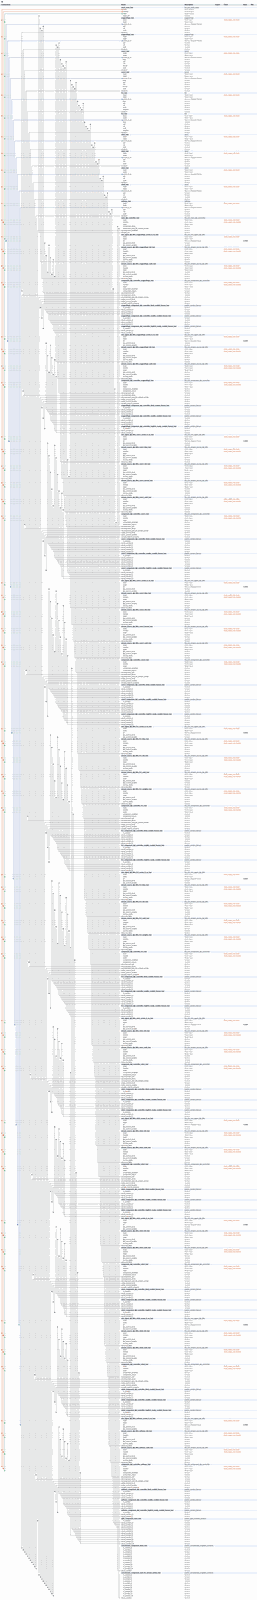
[diagram p0: system contents, whole]
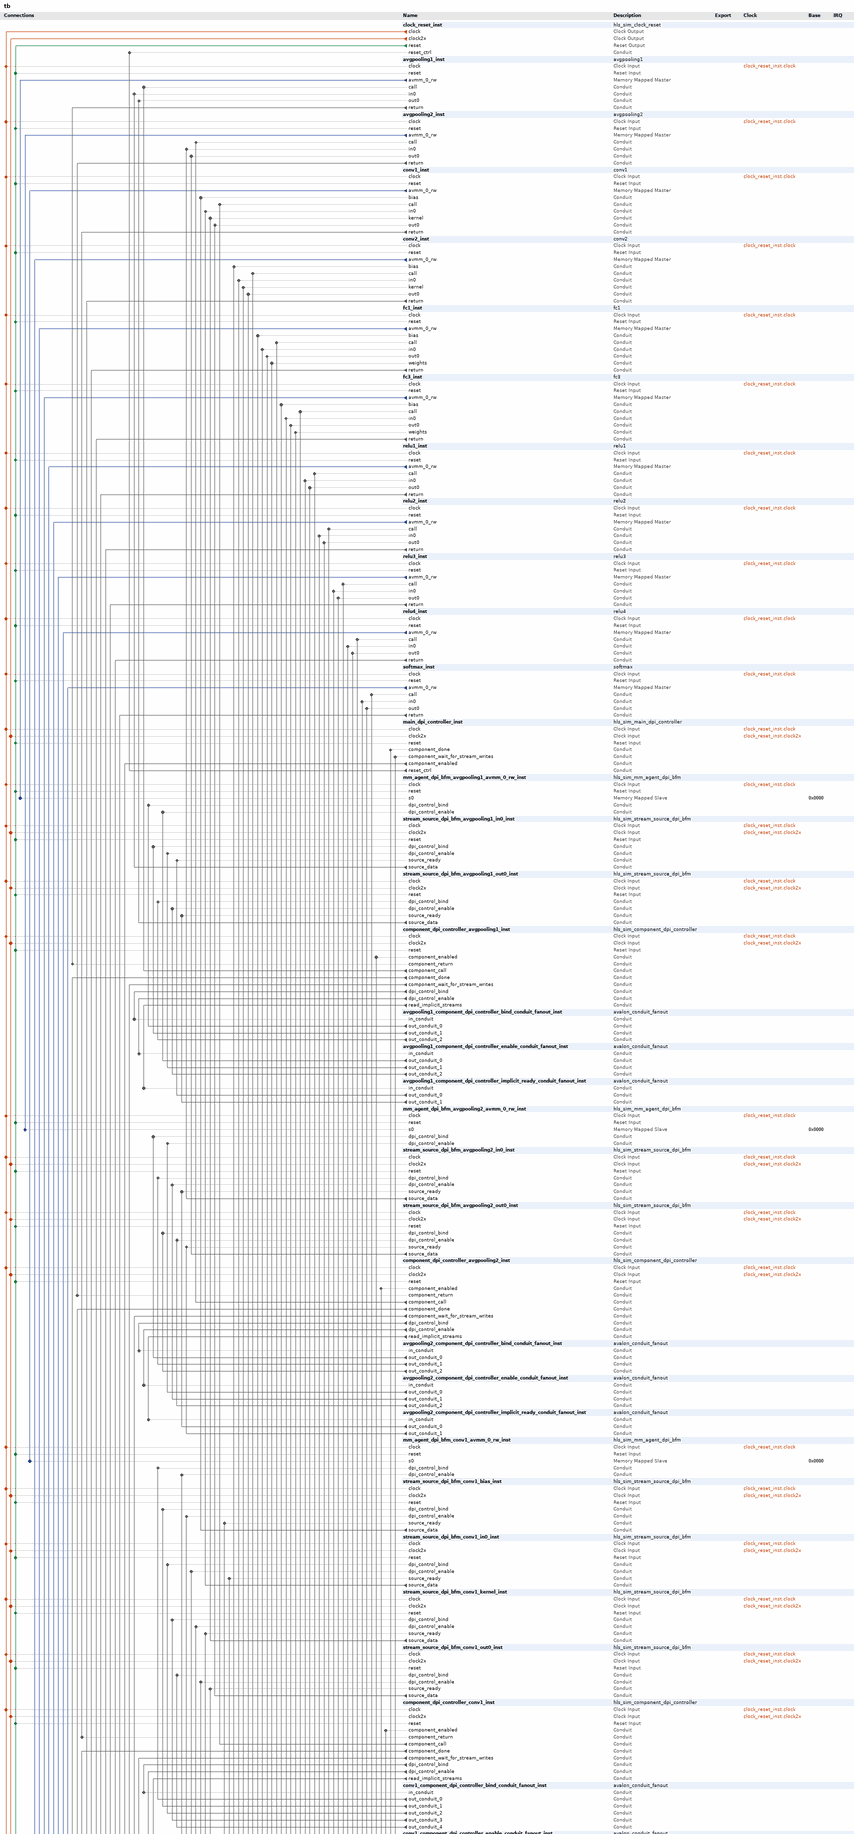
[diagram p1: system contents, upper part]
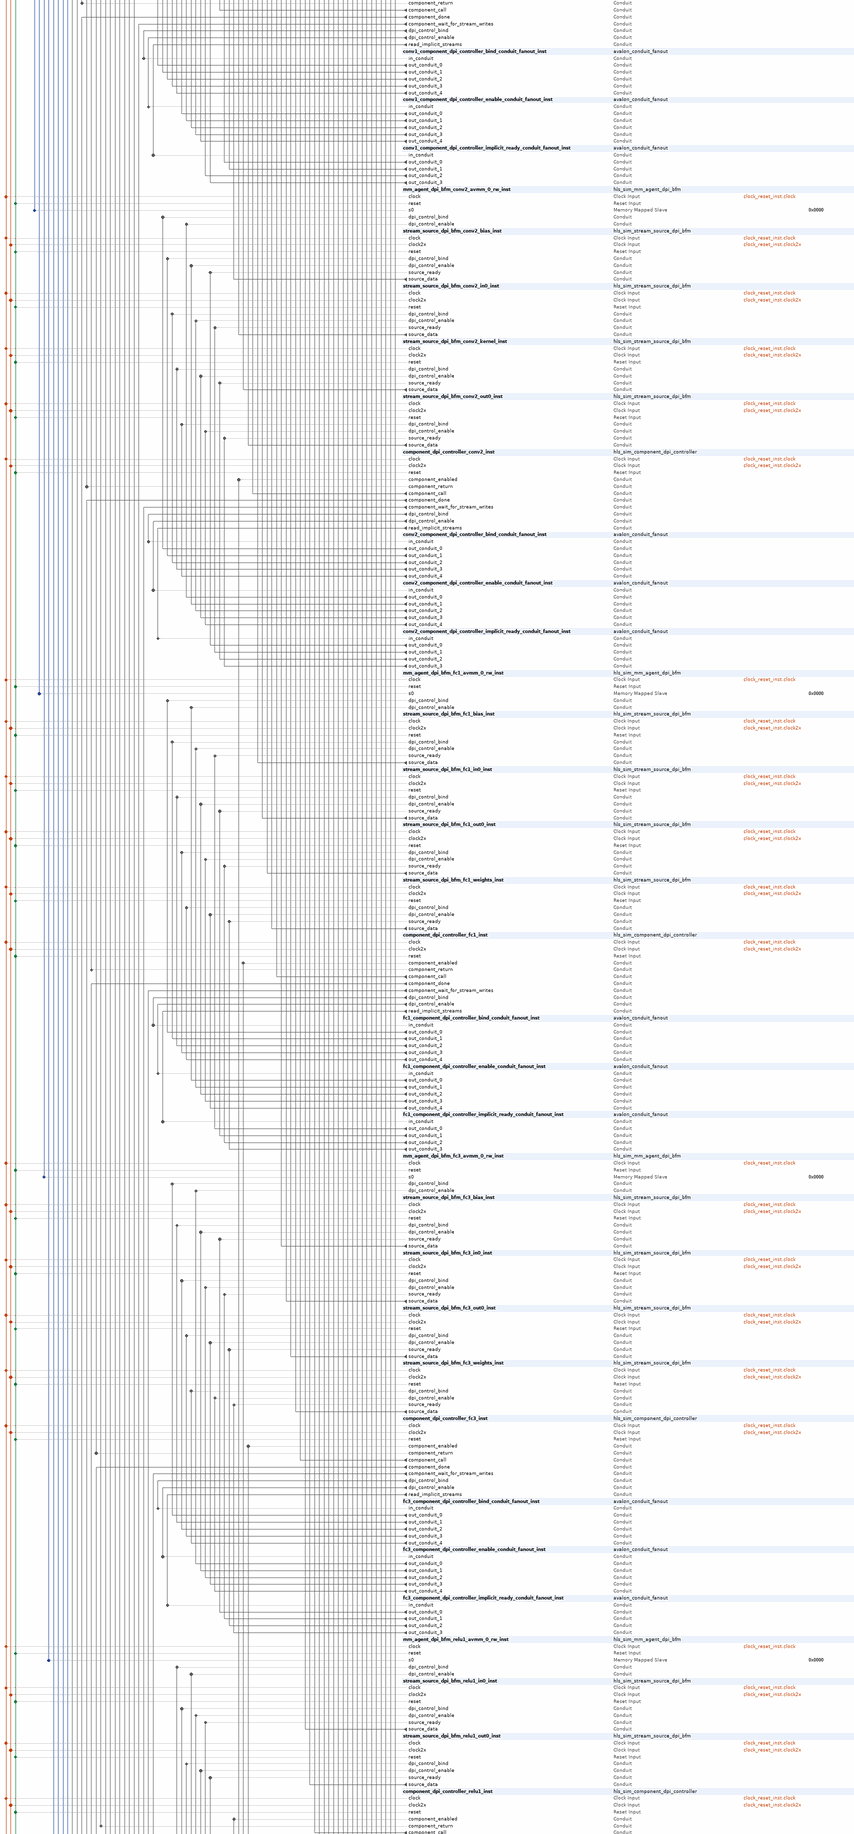
[diagram p2: system contents, middle part]
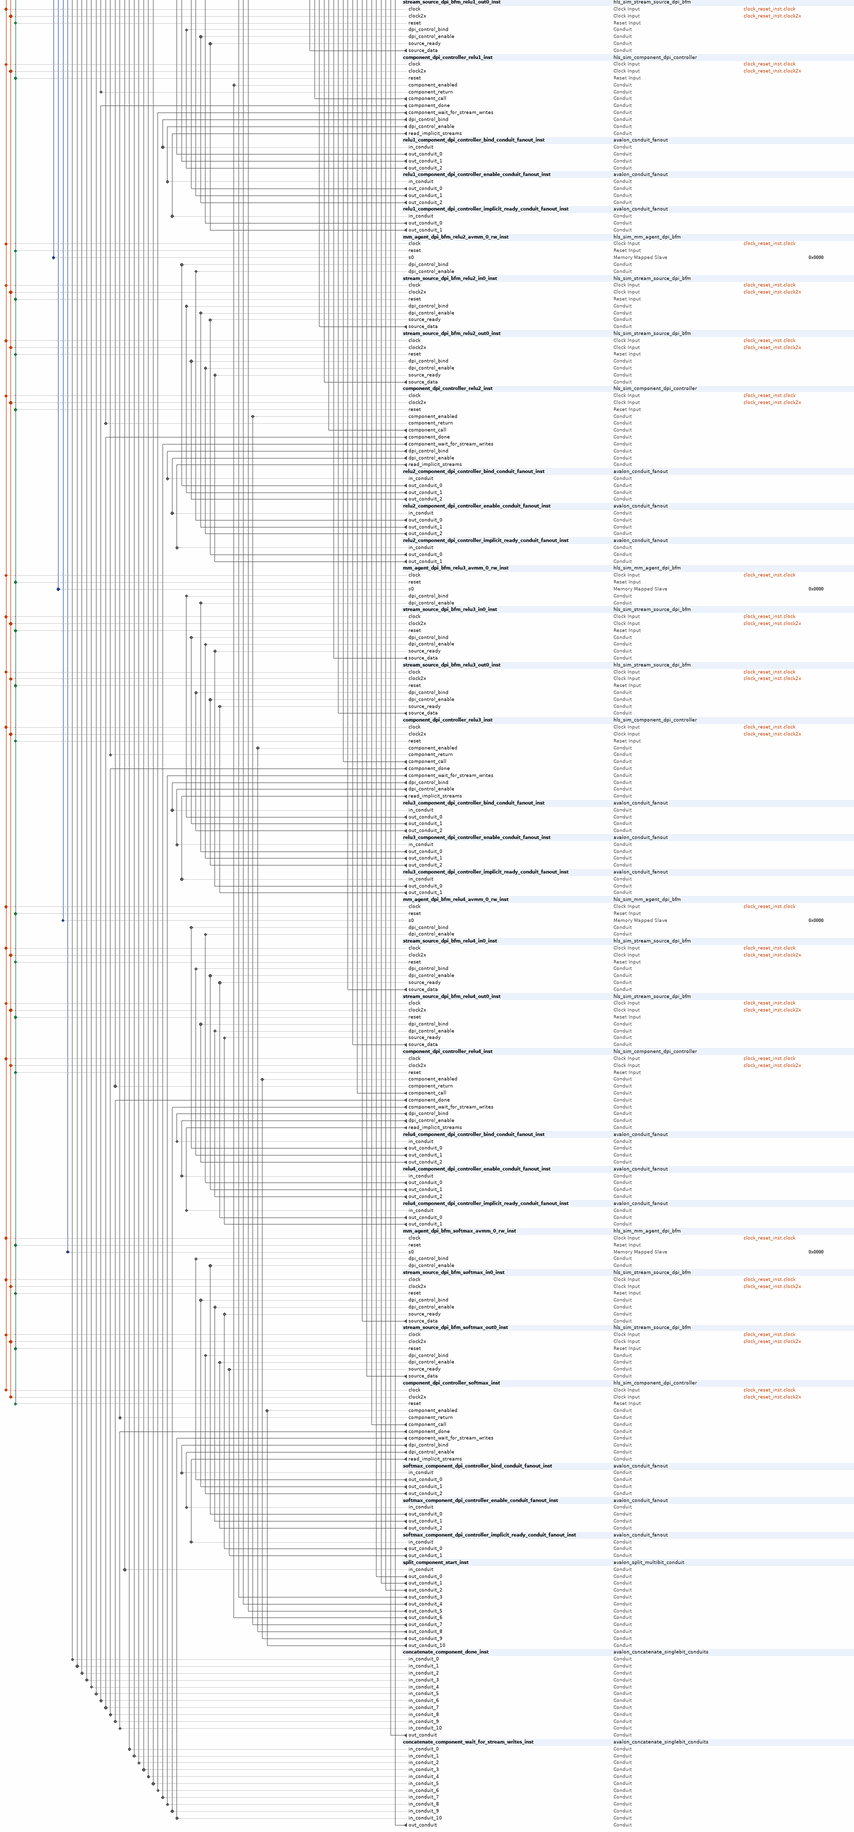
[diagram p3: system contents, lower part]
# Platform Designer (Qsys) system tb, Cyclone V 5CGXFC3B6F23C6
# Parameters at their usual value, and those the tool derives, are not listed.
package require qsys
create_system tb
set_project_property DEVICE_FAMILY {Cyclone V}
set_project_property DEVICE 5CGXFC3B6F23C6

add_instance clock_reset_inst hls_sim_clock_reset 1.0
set_instance_parameter_value clock_reset_inst RESET_CYCLE_HOLD 4

add_instance avgpooling1_inst avgpooling1 1.0

add_instance avgpooling2_inst avgpooling2 1.0

add_instance conv1_inst conv1 1.0

add_instance conv2_inst conv2 1.0

add_instance fc1_inst fc1 1.0

add_instance fc3_inst fc3 1.0

add_instance relu1_inst relu1 1.0

add_instance relu2_inst relu2 1.0

add_instance relu3_inst relu3 1.0

add_instance relu4_inst relu4 1.0

add_instance softmax_inst softmax 1.0

add_instance main_dpi_controller_inst hls_sim_main_dpi_controller 1.0
set_instance_parameter_value main_dpi_controller_inst COMPONENT_NAMES_STR avgpooling1,avgpooling2,conv1,conv2,fc1,fc3,relu1,relu2,relu3,relu4,softmax
set_instance_parameter_value main_dpi_controller_inst NUM_COMPONENTS 11

add_instance mm_agent_dpi_bfm_avgpooling1_avmm_0_rw_inst hls_sim_mm_agent_dpi_bfm 1.0
set_instance_parameter_value mm_agent_dpi_bfm_avgpooling1_avmm_0_rw_inst ADDRESS_UNITS SYMBOLS
set_instance_parameter_value mm_agent_dpi_bfm_avgpooling1_avmm_0_rw_inst ASSERT_HIGH_ARBITERLOCK 1
set_instance_parameter_value mm_agent_dpi_bfm_avgpooling1_avmm_0_rw_inst ASSERT_HIGH_BYTEENABLE 1
set_instance_parameter_value mm_agent_dpi_bfm_avgpooling1_avmm_0_rw_inst ASSERT_HIGH_LOCK 1
set_instance_parameter_value mm_agent_dpi_bfm_avgpooling1_avmm_0_rw_inst ASSERT_HIGH_READ 1
set_instance_parameter_value mm_agent_dpi_bfm_avgpooling1_avmm_0_rw_inst ASSERT_HIGH_READDATAVALID 1
set_instance_parameter_value mm_agent_dpi_bfm_avgpooling1_avmm_0_rw_inst ASSERT_HIGH_WAITREQUEST 1
set_instance_parameter_value mm_agent_dpi_bfm_avgpooling1_avmm_0_rw_inst ASSERT_HIGH_WRITE 1
set_instance_parameter_value mm_agent_dpi_bfm_avgpooling1_avmm_0_rw_inst AV_ADDRESS_W 64
set_instance_parameter_value mm_agent_dpi_bfm_avgpooling1_avmm_0_rw_inst AV_BURSTCOUNT_W 3
set_instance_parameter_value mm_agent_dpi_bfm_avgpooling1_avmm_0_rw_inst AV_BURST_BNDR_ONLY 1
set_instance_parameter_value mm_agent_dpi_bfm_avgpooling1_avmm_0_rw_inst AV_BURST_LINEWRAP 1
set_instance_parameter_value mm_agent_dpi_bfm_avgpooling1_avmm_0_rw_inst AV_FIX_READ_LATENCY 1
set_instance_parameter_value mm_agent_dpi_bfm_avgpooling1_avmm_0_rw_inst AV_MAX_PENDING_READS 0
set_instance_parameter_value mm_agent_dpi_bfm_avgpooling1_avmm_0_rw_inst AV_MAX_PENDING_WRITES 0
set_instance_parameter_value mm_agent_dpi_bfm_avgpooling1_avmm_0_rw_inst AV_NUMSYMBOLS 8
set_instance_parameter_value mm_agent_dpi_bfm_avgpooling1_avmm_0_rw_inst AV_READRESPONSE_W 8
set_instance_parameter_value mm_agent_dpi_bfm_avgpooling1_avmm_0_rw_inst AV_READ_WAIT_TIME 0
set_instance_parameter_value mm_agent_dpi_bfm_avgpooling1_avmm_0_rw_inst AV_REGISTERINCOMINGSIGNALS 0
set_instance_parameter_value mm_agent_dpi_bfm_avgpooling1_avmm_0_rw_inst AV_SYMBOL_W 8
set_instance_parameter_value mm_agent_dpi_bfm_avgpooling1_avmm_0_rw_inst AV_WRITERESPONSE_W 8
set_instance_parameter_value mm_agent_dpi_bfm_avgpooling1_avmm_0_rw_inst AV_WRITE_WAIT_TIME 0
set_instance_parameter_value mm_agent_dpi_bfm_avgpooling1_avmm_0_rw_inst COMPONENT_NAME avgpooling1
set_instance_parameter_value mm_agent_dpi_bfm_avgpooling1_avmm_0_rw_inst INTERFACE_ID 0
set_instance_parameter_value mm_agent_dpi_bfm_avgpooling1_avmm_0_rw_inst REGISTER_WAITREQUEST 0
set_instance_parameter_value mm_agent_dpi_bfm_avgpooling1_avmm_0_rw_inst USE_ADDRESS 1
set_instance_parameter_value mm_agent_dpi_bfm_avgpooling1_avmm_0_rw_inst USE_ARBITERLOCK 0
set_instance_parameter_value mm_agent_dpi_bfm_avgpooling1_avmm_0_rw_inst USE_BEGIN_BURST_TRANSFER 0
set_instance_parameter_value mm_agent_dpi_bfm_avgpooling1_avmm_0_rw_inst USE_BEGIN_TRANSFER 0
set_instance_parameter_value mm_agent_dpi_bfm_avgpooling1_avmm_0_rw_inst USE_BURSTCOUNT 0
set_instance_parameter_value mm_agent_dpi_bfm_avgpooling1_avmm_0_rw_inst USE_BYTE_ENABLE 1
set_instance_parameter_value mm_agent_dpi_bfm_avgpooling1_avmm_0_rw_inst USE_CLKEN 0
set_instance_parameter_value mm_agent_dpi_bfm_avgpooling1_avmm_0_rw_inst USE_DEBUGACCESS 0
set_instance_parameter_value mm_agent_dpi_bfm_avgpooling1_avmm_0_rw_inst USE_LOCK 0
set_instance_parameter_value mm_agent_dpi_bfm_avgpooling1_avmm_0_rw_inst USE_READ 1
set_instance_parameter_value mm_agent_dpi_bfm_avgpooling1_avmm_0_rw_inst USE_READ_DATA 1
set_instance_parameter_value mm_agent_dpi_bfm_avgpooling1_avmm_0_rw_inst USE_READ_DATA_VALID 0
set_instance_parameter_value mm_agent_dpi_bfm_avgpooling1_avmm_0_rw_inst USE_WAIT_REQUEST 0
set_instance_parameter_value mm_agent_dpi_bfm_avgpooling1_avmm_0_rw_inst USE_WRITE 1
set_instance_parameter_value mm_agent_dpi_bfm_avgpooling1_avmm_0_rw_inst USE_WRITE_DATA 1

add_instance stream_source_dpi_bfm_avgpooling1_in0_inst hls_sim_stream_source_dpi_bfm 1.0
set_instance_parameter_value stream_source_dpi_bfm_avgpooling1_in0_inst COMPONENT_NAME avgpooling1
set_instance_parameter_value stream_source_dpi_bfm_avgpooling1_in0_inst EMPTY_WIDTH 0
set_instance_parameter_value stream_source_dpi_bfm_avgpooling1_in0_inst FIRST_SYMBOL_IN_HIGH_ORDER_BITS 0
set_instance_parameter_value stream_source_dpi_bfm_avgpooling1_in0_inst FORCE_STREAM_CONDUIT 1
set_instance_parameter_value stream_source_dpi_bfm_avgpooling1_in0_inst INTERFACE_NAME in
set_instance_parameter_value stream_source_dpi_bfm_avgpooling1_in0_inst STREAM_BITSPERSYMBOL 1
set_instance_parameter_value stream_source_dpi_bfm_avgpooling1_in0_inst STREAM_DATAWIDTH 64
set_instance_parameter_value stream_source_dpi_bfm_avgpooling1_in0_inst USES_PACKETS 0

add_instance stream_source_dpi_bfm_avgpooling1_out0_inst hls_sim_stream_source_dpi_bfm 1.0
set_instance_parameter_value stream_source_dpi_bfm_avgpooling1_out0_inst COMPONENT_NAME avgpooling1
set_instance_parameter_value stream_source_dpi_bfm_avgpooling1_out0_inst EMPTY_WIDTH 0
set_instance_parameter_value stream_source_dpi_bfm_avgpooling1_out0_inst FIRST_SYMBOL_IN_HIGH_ORDER_BITS 0
set_instance_parameter_value stream_source_dpi_bfm_avgpooling1_out0_inst FORCE_STREAM_CONDUIT 1
set_instance_parameter_value stream_source_dpi_bfm_avgpooling1_out0_inst INTERFACE_NAME out
set_instance_parameter_value stream_source_dpi_bfm_avgpooling1_out0_inst STREAM_BITSPERSYMBOL 1
set_instance_parameter_value stream_source_dpi_bfm_avgpooling1_out0_inst STREAM_DATAWIDTH 64
set_instance_parameter_value stream_source_dpi_bfm_avgpooling1_out0_inst USES_PACKETS 0

add_instance component_dpi_controller_avgpooling1_inst hls_sim_component_dpi_controller 1.0
set_instance_parameter_value component_dpi_controller_avgpooling1_inst COMPONENT_HAS_AGENT_RETURN 0
set_instance_parameter_value component_dpi_controller_avgpooling1_inst COMPONENT_MANGLED_NAME "\\3favgpooling1@@YAXQEAY1BM@BM@MQEAY1O@O@M@Z"
set_instance_parameter_value component_dpi_controller_avgpooling1_inst COMPONENT_NAME avgpooling1
set_instance_parameter_value component_dpi_controller_avgpooling1_inst COMPONENT_NUM_AGENTS 0
set_instance_parameter_value component_dpi_controller_avgpooling1_inst COMPONENT_NUM_OUTPUT_STREAMS 0
set_instance_parameter_value component_dpi_controller_avgpooling1_inst RETURN_DATAWIDTH 64

add_instance avgpooling1_component_dpi_controller_bind_conduit_fanout_inst avalon_conduit_fanout 1.0
set_instance_parameter_value avgpooling1_component_dpi_controller_bind_conduit_fanout_inst numFanOut 3

add_instance avgpooling1_component_dpi_controller_enable_conduit_fanout_inst avalon_conduit_fanout 1.0
set_instance_parameter_value avgpooling1_component_dpi_controller_enable_conduit_fanout_inst numFanOut 3

add_instance avgpooling1_component_dpi_controller_implicit_ready_conduit_fanout_inst avalon_conduit_fanout 1.0
set_instance_parameter_value avgpooling1_component_dpi_controller_implicit_ready_conduit_fanout_inst numFanOut 2

add_instance mm_agent_dpi_bfm_avgpooling2_avmm_0_rw_inst hls_sim_mm_agent_dpi_bfm 1.0
set_instance_parameter_value mm_agent_dpi_bfm_avgpooling2_avmm_0_rw_inst ADDRESS_UNITS SYMBOLS
set_instance_parameter_value mm_agent_dpi_bfm_avgpooling2_avmm_0_rw_inst ASSERT_HIGH_ARBITERLOCK 1
set_instance_parameter_value mm_agent_dpi_bfm_avgpooling2_avmm_0_rw_inst ASSERT_HIGH_BYTEENABLE 1
set_instance_parameter_value mm_agent_dpi_bfm_avgpooling2_avmm_0_rw_inst ASSERT_HIGH_LOCK 1
set_instance_parameter_value mm_agent_dpi_bfm_avgpooling2_avmm_0_rw_inst ASSERT_HIGH_READ 1
set_instance_parameter_value mm_agent_dpi_bfm_avgpooling2_avmm_0_rw_inst ASSERT_HIGH_READDATAVALID 1
set_instance_parameter_value mm_agent_dpi_bfm_avgpooling2_avmm_0_rw_inst ASSERT_HIGH_WAITREQUEST 1
set_instance_parameter_value mm_agent_dpi_bfm_avgpooling2_avmm_0_rw_inst ASSERT_HIGH_WRITE 1
set_instance_parameter_value mm_agent_dpi_bfm_avgpooling2_avmm_0_rw_inst AV_ADDRESS_W 64
set_instance_parameter_value mm_agent_dpi_bfm_avgpooling2_avmm_0_rw_inst AV_BURSTCOUNT_W 3
set_instance_parameter_value mm_agent_dpi_bfm_avgpooling2_avmm_0_rw_inst AV_BURST_BNDR_ONLY 1
set_instance_parameter_value mm_agent_dpi_bfm_avgpooling2_avmm_0_rw_inst AV_BURST_LINEWRAP 1
set_instance_parameter_value mm_agent_dpi_bfm_avgpooling2_avmm_0_rw_inst AV_FIX_READ_LATENCY 1
set_instance_parameter_value mm_agent_dpi_bfm_avgpooling2_avmm_0_rw_inst AV_MAX_PENDING_READS 0
set_instance_parameter_value mm_agent_dpi_bfm_avgpooling2_avmm_0_rw_inst AV_MAX_PENDING_WRITES 0
set_instance_parameter_value mm_agent_dpi_bfm_avgpooling2_avmm_0_rw_inst AV_NUMSYMBOLS 8
set_instance_parameter_value mm_agent_dpi_bfm_avgpooling2_avmm_0_rw_inst AV_READRESPONSE_W 8
set_instance_parameter_value mm_agent_dpi_bfm_avgpooling2_avmm_0_rw_inst AV_READ_WAIT_TIME 0
set_instance_parameter_value mm_agent_dpi_bfm_avgpooling2_avmm_0_rw_inst AV_REGISTERINCOMINGSIGNALS 0
set_instance_parameter_value mm_agent_dpi_bfm_avgpooling2_avmm_0_rw_inst AV_SYMBOL_W 8
set_instance_parameter_value mm_agent_dpi_bfm_avgpooling2_avmm_0_rw_inst AV_WRITERESPONSE_W 8
set_instance_parameter_value mm_agent_dpi_bfm_avgpooling2_avmm_0_rw_inst AV_WRITE_WAIT_TIME 0
set_instance_parameter_value mm_agent_dpi_bfm_avgpooling2_avmm_0_rw_inst COMPONENT_NAME avgpooling2
set_instance_parameter_value mm_agent_dpi_bfm_avgpooling2_avmm_0_rw_inst INTERFACE_ID 0
set_instance_parameter_value mm_agent_dpi_bfm_avgpooling2_avmm_0_rw_inst REGISTER_WAITREQUEST 0
set_instance_parameter_value mm_agent_dpi_bfm_avgpooling2_avmm_0_rw_inst USE_ADDRESS 1
set_instance_parameter_value mm_agent_dpi_bfm_avgpooling2_avmm_0_rw_inst USE_ARBITERLOCK 0
set_instance_parameter_value mm_agent_dpi_bfm_avgpooling2_avmm_0_rw_inst USE_BEGIN_BURST_TRANSFER 0
set_instance_parameter_value mm_agent_dpi_bfm_avgpooling2_avmm_0_rw_inst USE_BEGIN_TRANSFER 0
set_instance_parameter_value mm_agent_dpi_bfm_avgpooling2_avmm_0_rw_inst USE_BURSTCOUNT 0
set_instance_parameter_value mm_agent_dpi_bfm_avgpooling2_avmm_0_rw_inst USE_BYTE_ENABLE 1
set_instance_parameter_value mm_agent_dpi_bfm_avgpooling2_avmm_0_rw_inst USE_CLKEN 0
set_instance_parameter_value mm_agent_dpi_bfm_avgpooling2_avmm_0_rw_inst USE_DEBUGACCESS 0
set_instance_parameter_value mm_agent_dpi_bfm_avgpooling2_avmm_0_rw_inst USE_LOCK 0
set_instance_parameter_value mm_agent_dpi_bfm_avgpooling2_avmm_0_rw_inst USE_READ 1
set_instance_parameter_value mm_agent_dpi_bfm_avgpooling2_avmm_0_rw_inst USE_READ_DATA 1
set_instance_parameter_value mm_agent_dpi_bfm_avgpooling2_avmm_0_rw_inst USE_READ_DATA_VALID 0
set_instance_parameter_value mm_agent_dpi_bfm_avgpooling2_avmm_0_rw_inst USE_WAIT_REQUEST 0
set_instance_parameter_value mm_agent_dpi_bfm_avgpooling2_avmm_0_rw_inst USE_WRITE 1
set_instance_parameter_value mm_agent_dpi_bfm_avgpooling2_avmm_0_rw_inst USE_WRITE_DATA 1

add_instance stream_source_dpi_bfm_avgpooling2_in0_inst hls_sim_stream_source_dpi_bfm 1.0
set_instance_parameter_value stream_source_dpi_bfm_avgpooling2_in0_inst COMPONENT_NAME avgpooling2
set_instance_parameter_value stream_source_dpi_bfm_avgpooling2_in0_inst EMPTY_WIDTH 0
set_instance_parameter_value stream_source_dpi_bfm_avgpooling2_in0_inst FIRST_SYMBOL_IN_HIGH_ORDER_BITS 0
set_instance_parameter_value stream_source_dpi_bfm_avgpooling2_in0_inst FORCE_STREAM_CONDUIT 1
set_instance_parameter_value stream_source_dpi_bfm_avgpooling2_in0_inst INTERFACE_NAME in
set_instance_parameter_value stream_source_dpi_bfm_avgpooling2_in0_inst STREAM_BITSPERSYMBOL 1
set_instance_parameter_value stream_source_dpi_bfm_avgpooling2_in0_inst STREAM_DATAWIDTH 64
set_instance_parameter_value stream_source_dpi_bfm_avgpooling2_in0_inst USES_PACKETS 0

add_instance stream_source_dpi_bfm_avgpooling2_out0_inst hls_sim_stream_source_dpi_bfm 1.0
set_instance_parameter_value stream_source_dpi_bfm_avgpooling2_out0_inst COMPONENT_NAME avgpooling2
set_instance_parameter_value stream_source_dpi_bfm_avgpooling2_out0_inst EMPTY_WIDTH 0
set_instance_parameter_value stream_source_dpi_bfm_avgpooling2_out0_inst FIRST_SYMBOL_IN_HIGH_ORDER_BITS 0
set_instance_parameter_value stream_source_dpi_bfm_avgpooling2_out0_inst FORCE_STREAM_CONDUIT 1
set_instance_parameter_value stream_source_dpi_bfm_avgpooling2_out0_inst INTERFACE_NAME out
set_instance_parameter_value stream_source_dpi_bfm_avgpooling2_out0_inst STREAM_BITSPERSYMBOL 1
set_instance_parameter_value stream_source_dpi_bfm_avgpooling2_out0_inst STREAM_DATAWIDTH 64
set_instance_parameter_value stream_source_dpi_bfm_avgpooling2_out0_inst USES_PACKETS 0

add_instance component_dpi_controller_avgpooling2_inst hls_sim_component_dpi_controller 1.0
set_instance_parameter_value component_dpi_controller_avgpooling2_inst COMPONENT_HAS_AGENT_RETURN 0
set_instance_parameter_value component_dpi_controller_avgpooling2_inst COMPONENT_MANGLED_NAME "\\3favgpooling2@@YAXQEAY199MQEAY144M@Z"
set_instance_parameter_value component_dpi_controller_avgpooling2_inst COMPONENT_NAME avgpooling2
set_instance_parameter_value component_dpi_controller_avgpooling2_inst COMPONENT_NUM_AGENTS 0
set_instance_parameter_value component_dpi_controller_avgpooling2_inst COMPONENT_NUM_OUTPUT_STREAMS 0
set_instance_parameter_value component_dpi_controller_avgpooling2_inst RETURN_DATAWIDTH 64

add_instance avgpooling2_component_dpi_controller_bind_conduit_fanout_inst avalon_conduit_fanout 1.0
set_instance_parameter_value avgpooling2_component_dpi_controller_bind_conduit_fanout_inst numFanOut 3

add_instance avgpooling2_component_dpi_controller_enable_conduit_fanout_inst avalon_conduit_fanout 1.0
set_instance_parameter_value avgpooling2_component_dpi_controller_enable_conduit_fanout_inst numFanOut 3

add_instance avgpooling2_component_dpi_controller_implicit_ready_conduit_fanout_inst avalon_conduit_fanout 1.0
set_instance_parameter_value avgpooling2_component_dpi_controller_implicit_ready_conduit_fanout_inst numFanOut 2

add_instance mm_agent_dpi_bfm_conv1_avmm_0_rw_inst hls_sim_mm_agent_dpi_bfm 1.0
set_instance_parameter_value mm_agent_dpi_bfm_conv1_avmm_0_rw_inst ADDRESS_UNITS SYMBOLS
set_instance_parameter_value mm_agent_dpi_bfm_conv1_avmm_0_rw_inst ASSERT_HIGH_ARBITERLOCK 1
set_instance_parameter_value mm_agent_dpi_bfm_conv1_avmm_0_rw_inst ASSERT_HIGH_BYTEENABLE 1
set_instance_parameter_value mm_agent_dpi_bfm_conv1_avmm_0_rw_inst ASSERT_HIGH_LOCK 1
set_instance_parameter_value mm_agent_dpi_bfm_conv1_avmm_0_rw_inst ASSERT_HIGH_READ 1
set_instance_parameter_value mm_agent_dpi_bfm_conv1_avmm_0_rw_inst ASSERT_HIGH_READDATAVALID 1
set_instance_parameter_value mm_agent_dpi_bfm_conv1_avmm_0_rw_inst ASSERT_HIGH_WAITREQUEST 1
set_instance_parameter_value mm_agent_dpi_bfm_conv1_avmm_0_rw_inst ASSERT_HIGH_WRITE 1
set_instance_parameter_value mm_agent_dpi_bfm_conv1_avmm_0_rw_inst AV_ADDRESS_W 64
set_instance_parameter_value mm_agent_dpi_bfm_conv1_avmm_0_rw_inst AV_BURSTCOUNT_W 3
set_instance_parameter_value mm_agent_dpi_bfm_conv1_avmm_0_rw_inst AV_BURST_BNDR_ONLY 1
set_instance_parameter_value mm_agent_dpi_bfm_conv1_avmm_0_rw_inst AV_BURST_LINEWRAP 1
set_instance_parameter_value mm_agent_dpi_bfm_conv1_avmm_0_rw_inst AV_FIX_READ_LATENCY 1
set_instance_parameter_value mm_agent_dpi_bfm_conv1_avmm_0_rw_inst AV_MAX_PENDING_READS 0
set_instance_parameter_value mm_agent_dpi_bfm_conv1_avmm_0_rw_inst AV_MAX_PENDING_WRITES 0
set_instance_parameter_value mm_agent_dpi_bfm_conv1_avmm_0_rw_inst AV_NUMSYMBOLS 8
set_instance_parameter_value mm_agent_dpi_bfm_conv1_avmm_0_rw_inst AV_READRESPONSE_W 8
set_instance_parameter_value mm_agent_dpi_bfm_conv1_avmm_0_rw_inst AV_READ_WAIT_TIME 0
set_instance_parameter_value mm_agent_dpi_bfm_conv1_avmm_0_rw_inst AV_REGISTERINCOMINGSIGNALS 0
set_instance_parameter_value mm_agent_dpi_bfm_conv1_avmm_0_rw_inst AV_SYMBOL_W 8
set_instance_parameter_value mm_agent_dpi_bfm_conv1_avmm_0_rw_inst AV_WRITERESPONSE_W 8
set_instance_parameter_value mm_agent_dpi_bfm_conv1_avmm_0_rw_inst AV_WRITE_WAIT_TIME 0
set_instance_parameter_value mm_agent_dpi_bfm_conv1_avmm_0_rw_inst COMPONENT_NAME conv1
set_instance_parameter_value mm_agent_dpi_bfm_conv1_avmm_0_rw_inst INTERFACE_ID 0
set_instance_parameter_value mm_agent_dpi_bfm_conv1_avmm_0_rw_inst REGISTER_WAITREQUEST 0
set_instance_parameter_value mm_agent_dpi_bfm_conv1_avmm_0_rw_inst USE_ADDRESS 1
set_instance_parameter_value mm_agent_dpi_bfm_conv1_avmm_0_rw_inst USE_ARBITERLOCK 0
set_instance_parameter_value mm_agent_dpi_bfm_conv1_avmm_0_rw_inst USE_BEGIN_BURST_TRANSFER 0
set_instance_parameter_value mm_agent_dpi_bfm_conv1_avmm_0_rw_inst USE_BEGIN_TRANSFER 0
set_instance_parameter_value mm_agent_dpi_bfm_conv1_avmm_0_rw_inst USE_BURSTCOUNT 0
set_instance_parameter_value mm_agent_dpi_bfm_conv1_avmm_0_rw_inst USE_BYTE_ENABLE 1
set_instance_parameter_value mm_agent_dpi_bfm_conv1_avmm_0_rw_inst USE_CLKEN 0
set_instance_parameter_value mm_agent_dpi_bfm_conv1_avmm_0_rw_inst USE_DEBUGACCESS 0
set_instance_parameter_value mm_agent_dpi_bfm_conv1_avmm_0_rw_inst USE_LOCK 0
set_instance_parameter_value mm_agent_dpi_bfm_conv1_avmm_0_rw_inst USE_READ 1
set_instance_parameter_value mm_agent_dpi_bfm_conv1_avmm_0_rw_inst USE_READ_DATA 1
set_instance_parameter_value mm_agent_dpi_bfm_conv1_avmm_0_rw_inst USE_READ_DATA_VALID 0
set_instance_parameter_value mm_agent_dpi_bfm_conv1_avmm_0_rw_inst USE_WAIT_REQUEST 0
set_instance_parameter_value mm_agent_dpi_bfm_conv1_avmm_0_rw_inst USE_WRITE 1
set_instance_parameter_value mm_agent_dpi_bfm_conv1_avmm_0_rw_inst USE_WRITE_DATA 1

add_instance stream_source_dpi_bfm_conv1_bias_inst hls_sim_stream_source_dpi_bfm 1.0
set_instance_parameter_value stream_source_dpi_bfm_conv1_bias_inst COMPONENT_NAME conv1
set_instance_parameter_value stream_source_dpi_bfm_conv1_bias_inst EMPTY_WIDTH 0
set_instance_parameter_value stream_source_dpi_bfm_conv1_bias_inst FIRST_SYMBOL_IN_HIGH_ORDER_BITS 0
set_instance_parameter_value stream_source_dpi_bfm_conv1_bias_inst FORCE_STREAM_CONDUIT 1
set_instance_parameter_value stream_source_dpi_bfm_conv1_bias_inst INTERFACE_NAME bias
set_instance_parameter_value stream_source_dpi_bfm_conv1_bias_inst STREAM_BITSPERSYMBOL 1
set_instance_parameter_value stream_source_dpi_bfm_conv1_bias_inst STREAM_DATAWIDTH 64
set_instance_parameter_value stream_source_dpi_bfm_conv1_bias_inst USES_PACKETS 0

add_instance stream_source_dpi_bfm_conv1_in0_inst hls_sim_stream_source_dpi_bfm 1.0
set_instance_parameter_value stream_source_dpi_bfm_conv1_in0_inst COMPONENT_NAME conv1
set_instance_parameter_value stream_source_dpi_bfm_conv1_in0_inst EMPTY_WIDTH 0
set_instance_parameter_value stream_source_dpi_bfm_conv1_in0_inst FIRST_SYMBOL_IN_HIGH_ORDER_BITS 0
set_instance_parameter_value stream_source_dpi_bfm_conv1_in0_inst FORCE_STREAM_CONDUIT 1
set_instance_parameter_value stream_source_dpi_bfm_conv1_in0_inst INTERFACE_NAME in
set_instance_parameter_value stream_source_dpi_bfm_conv1_in0_inst STREAM_BITSPERSYMBOL 1
set_instance_parameter_value stream_source_dpi_bfm_conv1_in0_inst STREAM_DATAWIDTH 64
set_instance_parameter_value stream_source_dpi_bfm_conv1_in0_inst USES_PACKETS 0

add_instance stream_source_dpi_bfm_conv1_kernel_inst hls_sim_stream_source_dpi_bfm 1.0
set_instance_parameter_value stream_source_dpi_bfm_conv1_kernel_inst COMPONENT_NAME conv1
set_instance_parameter_value stream_source_dpi_bfm_conv1_kernel_inst EMPTY_WIDTH 0
set_instance_parameter_value stream_source_dpi_bfm_conv1_kernel_inst FIRST_SYMBOL_IN_HIGH_ORDER_BITS 0
set_instance_parameter_value stream_source_dpi_bfm_conv1_kernel_inst FORCE_STREAM_CONDUIT 1
set_instance_parameter_value stream_source_dpi_bfm_conv1_kernel_inst INTERFACE_NAME kernel
set_instance_parameter_value stream_source_dpi_bfm_conv1_kernel_inst STREAM_BITSPERSYMBOL 1
set_instance_parameter_value stream_source_dpi_bfm_conv1_kernel_inst STREAM_DATAWIDTH 64
set_instance_parameter_value stream_source_dpi_bfm_conv1_kernel_inst USES_PACKETS 0

add_instance stream_source_dpi_bfm_conv1_out0_inst hls_sim_stream_source_dpi_bfm 1.0
set_instance_parameter_value stream_source_dpi_bfm_conv1_out0_inst COMPONENT_NAME conv1
set_instance_parameter_value stream_source_dpi_bfm_conv1_out0_inst EMPTY_WIDTH 0
set_instance_parameter_value stream_source_dpi_bfm_conv1_out0_inst FIRST_SYMBOL_IN_HIGH_ORDER_BITS 0
set_instance_parameter_value stream_source_dpi_bfm_conv1_out0_inst FORCE_STREAM_CONDUIT 1
set_instance_parameter_value stream_source_dpi_bfm_conv1_out0_inst INTERFACE_NAME out
set_instance_parameter_value stream_source_dpi_bfm_conv1_out0_inst STREAM_BITSPERSYMBOL 1
set_instance_parameter_value stream_source_dpi_bfm_conv1_out0_inst STREAM_DATAWIDTH 64
set_instance_parameter_value stream_source_dpi_bfm_conv1_out0_inst USES_PACKETS 0

add_instance component_dpi_controller_conv1_inst hls_sim_component_dpi_controller 1.0
set_instance_parameter_value component_dpi_controller_conv1_inst COMPONENT_HAS_AGENT_RETURN 0
set_instance_parameter_value component_dpi_controller_conv1_inst COMPONENT_MANGLED_NAME "\\3fconv1@@YAXQEAY0BM@MQEAY100MQEAMQEAY1BM@BM@M@Z"
set_instance_parameter_value component_dpi_controller_conv1_inst COMPONENT_NAME conv1
set_instance_parameter_value component_dpi_controller_conv1_inst COMPONENT_NUM_AGENTS 0
set_instance_parameter_value component_dpi_controller_conv1_inst COMPONENT_NUM_OUTPUT_STREAMS 0
set_instance_parameter_value component_dpi_controller_conv1_inst RETURN_DATAWIDTH 64

add_instance conv1_component_dpi_controller_bind_conduit_fanout_inst avalon_conduit_fanout 1.0
set_instance_parameter_value conv1_component_dpi_controller_bind_conduit_fanout_inst numFanOut 5

add_instance conv1_component_dpi_controller_enable_conduit_fanout_inst avalon_conduit_fanout 1.0
set_instance_parameter_value conv1_component_dpi_controller_enable_conduit_fanout_inst numFanOut 5

add_instance conv1_component_dpi_controller_implicit_ready_conduit_fanout_inst avalon_conduit_fanout 1.0
set_instance_parameter_value conv1_component_dpi_controller_implicit_ready_conduit_fanout_inst numFanOut 4

add_instance mm_agent_dpi_bfm_conv2_avmm_0_rw_inst hls_sim_mm_agent_dpi_bfm 1.0
set_instance_parameter_value mm_agent_dpi_bfm_conv2_avmm_0_rw_inst ADDRESS_UNITS SYMBOLS
set_instance_parameter_value mm_agent_dpi_bfm_conv2_avmm_0_rw_inst ASSERT_HIGH_ARBITERLOCK 1
set_instance_parameter_value mm_agent_dpi_bfm_conv2_avmm_0_rw_inst ASSERT_HIGH_BYTEENABLE 1
set_instance_parameter_value mm_agent_dpi_bfm_conv2_avmm_0_rw_inst ASSERT_HIGH_LOCK 1
set_instance_parameter_value mm_agent_dpi_bfm_conv2_avmm_0_rw_inst ASSERT_HIGH_READ 1
set_instance_parameter_value mm_agent_dpi_bfm_conv2_avmm_0_rw_inst ASSERT_HIGH_READDATAVALID 1
set_instance_parameter_value mm_agent_dpi_bfm_conv2_avmm_0_rw_inst ASSERT_HIGH_WAITREQUEST 1
set_instance_parameter_value mm_agent_dpi_bfm_conv2_avmm_0_rw_inst ASSERT_HIGH_WRITE 1
set_instance_parameter_value mm_agent_dpi_bfm_conv2_avmm_0_rw_inst AV_ADDRESS_W 64
set_instance_parameter_value mm_agent_dpi_bfm_conv2_avmm_0_rw_inst AV_BURSTCOUNT_W 3
set_instance_parameter_value mm_agent_dpi_bfm_conv2_avmm_0_rw_inst AV_BURST_BNDR_ONLY 1
set_instance_parameter_value mm_agent_dpi_bfm_conv2_avmm_0_rw_inst AV_BURST_LINEWRAP 1
set_instance_parameter_value mm_agent_dpi_bfm_conv2_avmm_0_rw_inst AV_FIX_READ_LATENCY 1
set_instance_parameter_value mm_agent_dpi_bfm_conv2_avmm_0_rw_inst AV_MAX_PENDING_READS 0
set_instance_parameter_value mm_agent_dpi_bfm_conv2_avmm_0_rw_inst AV_MAX_PENDING_WRITES 0
set_instance_parameter_value mm_agent_dpi_bfm_conv2_avmm_0_rw_inst AV_NUMSYMBOLS 8
set_instance_parameter_value mm_agent_dpi_bfm_conv2_avmm_0_rw_inst AV_READRESPONSE_W 8
set_instance_parameter_value mm_agent_dpi_bfm_conv2_avmm_0_rw_inst AV_READ_WAIT_TIME 0
set_instance_parameter_value mm_agent_dpi_bfm_conv2_avmm_0_rw_inst AV_REGISTERINCOMINGSIGNALS 0
set_instance_parameter_value mm_agent_dpi_bfm_conv2_avmm_0_rw_inst AV_SYMBOL_W 8
set_instance_parameter_value mm_agent_dpi_bfm_conv2_avmm_0_rw_inst AV_WRITERESPONSE_W 8
set_instance_parameter_value mm_agent_dpi_bfm_conv2_avmm_0_rw_inst AV_WRITE_WAIT_TIME 0
set_instance_parameter_value mm_agent_dpi_bfm_conv2_avmm_0_rw_inst COMPONENT_NAME conv2
set_instance_parameter_value mm_agent_dpi_bfm_conv2_avmm_0_rw_inst INTERFACE_ID 0
set_instance_parameter_value mm_agent_dpi_bfm_conv2_avmm_0_rw_inst REGISTER_WAITREQUEST 0
set_instance_parameter_value mm_agent_dpi_bfm_conv2_avmm_0_rw_inst USE_ADDRESS 1
set_instance_parameter_value mm_agent_dpi_bfm_conv2_avmm_0_rw_inst USE_ARBITERLOCK 0
set_instance_parameter_value mm_agent_dpi_bfm_conv2_avmm_0_rw_inst USE_BEGIN_BURST_TRANSFER 0
set_instance_parameter_value mm_agent_dpi_bfm_conv2_avmm_0_rw_inst USE_BEGIN_TRANSFER 0
set_instance_parameter_value mm_agent_dpi_bfm_conv2_avmm_0_rw_inst USE_BURSTCOUNT 0
set_instance_parameter_value mm_agent_dpi_bfm_conv2_avmm_0_rw_inst USE_BYTE_ENABLE 1
set_instance_parameter_value mm_agent_dpi_bfm_conv2_avmm_0_rw_inst USE_CLKEN 0
set_instance_parameter_value mm_agent_dpi_bfm_conv2_avmm_0_rw_inst USE_DEBUGACCESS 0
set_instance_parameter_value mm_agent_dpi_bfm_conv2_avmm_0_rw_inst USE_LOCK 0
set_instance_parameter_value mm_agent_dpi_bfm_conv2_avmm_0_rw_inst USE_READ 1
set_instance_parameter_value mm_agent_dpi_bfm_conv2_avmm_0_rw_inst USE_READ_DATA 1
set_instance_parameter_value mm_agent_dpi_bfm_conv2_avmm_0_rw_inst USE_READ_DATA_VALID 0
set_instance_parameter_value mm_agent_dpi_bfm_conv2_avmm_0_rw_inst USE_WAIT_REQUEST 0
set_instance_parameter_value mm_agent_dpi_bfm_conv2_avmm_0_rw_inst USE_WRITE 1
set_instance_parameter_value mm_agent_dpi_bfm_conv2_avmm_0_rw_inst USE_WRITE_DATA 1

add_instance stream_source_dpi_bfm_conv2_bias_inst hls_sim_stream_source_dpi_bfm 1.0
set_instance_parameter_value stream_source_dpi_bfm_conv2_bias_inst COMPONENT_NAME conv2
set_instance_parameter_value stream_source_dpi_bfm_conv2_bias_inst EMPTY_WIDTH 0
set_instance_parameter_value stream_source_dpi_bfm_conv2_bias_inst FIRST_SYMBOL_IN_HIGH_ORDER_BITS 0
set_instance_parameter_value stream_source_dpi_bfm_conv2_bias_inst FORCE_STREAM_CONDUIT 1
set_instance_parameter_value stream_source_dpi_bfm_conv2_bias_inst INTERFACE_NAME bias
set_instance_parameter_value stream_source_dpi_bfm_conv2_bias_inst STREAM_BITSPERSYMBOL 1
set_instance_parameter_value stream_source_dpi_bfm_conv2_bias_inst STREAM_DATAWIDTH 64
set_instance_parameter_value stream_source_dpi_bfm_conv2_bias_inst USES_PACKETS 0

add_instance stream_source_dpi_bfm_conv2_in0_inst hls_sim_stream_source_dpi_bfm 1.0
set_instance_parameter_value stream_source_dpi_bfm_conv2_in0_inst COMPONENT_NAME conv2
set_instance_parameter_value stream_source_dpi_bfm_conv2_in0_inst EMPTY_WIDTH 0
set_instance_parameter_value stream_source_dpi_bfm_conv2_in0_inst FIRST_SYMBOL_IN_HIGH_ORDER_BITS 0
set_instance_parameter_value stream_source_dpi_bfm_conv2_in0_inst FORCE_STREAM_CONDUIT 1
set_instance_parameter_value stream_source_dpi_bfm_conv2_in0_inst INTERFACE_NAME in
set_instance_parameter_value stream_source_dpi_bfm_conv2_in0_inst STREAM_BITSPERSYMBOL 1
set_instance_parameter_value stream_source_dpi_bfm_conv2_in0_inst STREAM_DATAWIDTH 64
set_instance_parameter_value stream_source_dpi_bfm_conv2_in0_inst USES_PACKETS 0

add_instance stream_source_dpi_bfm_conv2_kernel_inst hls_sim_stream_source_dpi_bfm 1.0
set_instance_parameter_value stream_source_dpi_bfm_conv2_kernel_inst COMPONENT_NAME conv2
set_instance_parameter_value stream_source_dpi_bfm_conv2_kernel_inst EMPTY_WIDTH 0
set_instance_parameter_value stream_source_dpi_bfm_conv2_kernel_inst FIRST_SYMBOL_IN_HIGH_ORDER_BITS 0
set_instance_parameter_value stream_source_dpi_bfm_conv2_kernel_inst FORCE_STREAM_CONDUIT 1
set_instance_parameter_value stream_source_dpi_bfm_conv2_kernel_inst INTERFACE_NAME kernel
set_instance_parameter_value stream_source_dpi_bfm_conv2_kernel_inst STREAM_BITSPERSYMBOL 1
set_instance_parameter_value stream_source_dpi_bfm_conv2_kernel_inst STREAM_DATAWIDTH 64
set_instance_parameter_value stream_source_dpi_bfm_conv2_kernel_inst USES_PACKETS 0

add_instance stream_source_dpi_bfm_conv2_out0_inst hls_sim_stream_source_dpi_bfm 1.0
set_instance_parameter_value stream_source_dpi_bfm_conv2_out0_inst COMPONENT_NAME conv2
set_instance_parameter_value stream_source_dpi_bfm_conv2_out0_inst EMPTY_WIDTH 0
set_instance_parameter_value stream_source_dpi_bfm_conv2_out0_inst FIRST_SYMBOL_IN_HIGH_ORDER_BITS 0
set_instance_parameter_value stream_source_dpi_bfm_conv2_out0_inst FORCE_STREAM_CONDUIT 1
set_instance_parameter_value stream_source_dpi_bfm_conv2_out0_inst INTERFACE_NAME out
set_instance_parameter_value stream_source_dpi_bfm_conv2_out0_inst STREAM_BITSPERSYMBOL 1
set_instance_parameter_value stream_source_dpi_bfm_conv2_out0_inst STREAM_DATAWIDTH 64
set_instance_parameter_value stream_source_dpi_bfm_conv2_out0_inst USES_PACKETS 0

add_instance component_dpi_controller_conv2_inst hls_sim_component_dpi_controller 1.0
set_instance_parameter_value component_dpi_controller_conv2_inst COMPONENT_HAS_AGENT_RETURN 0
set_instance_parameter_value component_dpi_controller_conv2_inst COMPONENT_MANGLED_NAME "\\3fconv2@@YAXQEAY1O@O@MQEAY2544MQEAMQEAY199M@Z"
set_instance_parameter_value component_dpi_controller_conv2_inst COMPONENT_NAME conv2
set_instance_parameter_value component_dpi_controller_conv2_inst COMPONENT_NUM_AGENTS 0
set_instance_parameter_value component_dpi_controller_conv2_inst COMPONENT_NUM_OUTPUT_STREAMS 0
set_instance_parameter_value component_dpi_controller_conv2_inst RETURN_DATAWIDTH 64

add_instance conv2_component_dpi_controller_bind_conduit_fanout_inst avalon_conduit_fanout 1.0
set_instance_parameter_value conv2_component_dpi_controller_bind_conduit_fanout_inst numFanOut 5

add_instance conv2_component_dpi_controller_enable_conduit_fanout_inst avalon_conduit_fanout 1.0
set_instance_parameter_value conv2_component_dpi_controller_enable_conduit_fanout_inst numFanOut 5

add_instance conv2_component_dpi_controller_implicit_ready_conduit_fanout_inst avalon_conduit_fanout 1.0
set_instance_parameter_value conv2_component_dpi_controller_implicit_ready_conduit_fanout_inst numFanOut 4

add_instance mm_agent_dpi_bfm_fc1_avmm_0_rw_inst hls_sim_mm_agent_dpi_bfm 1.0
set_instance_parameter_value mm_agent_dpi_bfm_fc1_avmm_0_rw_inst ADDRESS_UNITS SYMBOLS
set_instance_parameter_value mm_agent_dpi_bfm_fc1_avmm_0_rw_inst ASSERT_HIGH_ARBITERLOCK 1
set_instance_parameter_value mm_agent_dpi_bfm_fc1_avmm_0_rw_inst ASSERT_HIGH_BYTEENABLE 1
set_instance_parameter_value mm_agent_dpi_bfm_fc1_avmm_0_rw_inst ASSERT_HIGH_LOCK 1
set_instance_parameter_value mm_agent_dpi_bfm_fc1_avmm_0_rw_inst ASSERT_HIGH_READ 1
set_instance_parameter_value mm_agent_dpi_bfm_fc1_avmm_0_rw_inst ASSERT_HIGH_READDATAVALID 1
set_instance_parameter_value mm_agent_dpi_bfm_fc1_avmm_0_rw_inst ASSERT_HIGH_WAITREQUEST 1
set_instance_parameter_value mm_agent_dpi_bfm_fc1_avmm_0_rw_inst ASSERT_HIGH_WRITE 1
set_instance_parameter_value mm_agent_dpi_bfm_fc1_avmm_0_rw_inst AV_ADDRESS_W 64
set_instance_parameter_value mm_agent_dpi_bfm_fc1_avmm_0_rw_inst AV_BURSTCOUNT_W 3
set_instance_parameter_value mm_agent_dpi_bfm_fc1_avmm_0_rw_inst AV_BURST_BNDR_ONLY 1
set_instance_parameter_value mm_agent_dpi_bfm_fc1_avmm_0_rw_inst AV_BURST_LINEWRAP 1
set_instance_parameter_value mm_agent_dpi_bfm_fc1_avmm_0_rw_inst AV_FIX_READ_LATENCY 1
set_instance_parameter_value mm_agent_dpi_bfm_fc1_avmm_0_rw_inst AV_MAX_PENDING_READS 0
set_instance_parameter_value mm_agent_dpi_bfm_fc1_avmm_0_rw_inst AV_MAX_PENDING_WRITES 0
set_instance_parameter_value mm_agent_dpi_bfm_fc1_avmm_0_rw_inst AV_NUMSYMBOLS 8
set_instance_parameter_value mm_agent_dpi_bfm_fc1_avmm_0_rw_inst AV_READRESPONSE_W 8
set_instance_parameter_value mm_agent_dpi_bfm_fc1_avmm_0_rw_inst AV_READ_WAIT_TIME 0
set_instance_parameter_value mm_agent_dpi_bfm_fc1_avmm_0_rw_inst AV_REGISTERINCOMINGSIGNALS 0
set_instance_parameter_value mm_agent_dpi_bfm_fc1_avmm_0_rw_inst AV_SYMBOL_W 8
set_instance_parameter_value mm_agent_dpi_bfm_fc1_avmm_0_rw_inst AV_WRITERESPONSE_W 8
set_instance_parameter_value mm_agent_dpi_bfm_fc1_avmm_0_rw_inst AV_WRITE_WAIT_TIME 0
set_instance_parameter_value mm_agent_dpi_bfm_fc1_avmm_0_rw_inst COMPONENT_NAME fc1
set_instance_parameter_value mm_agent_dpi_bfm_fc1_avmm_0_rw_inst INTERFACE_ID 0
set_instance_parameter_value mm_agent_dpi_bfm_fc1_avmm_0_rw_inst REGISTER_WAITREQUEST 0
set_instance_parameter_value mm_agent_dpi_bfm_fc1_avmm_0_rw_inst USE_ADDRESS 1
set_instance_parameter_value mm_agent_dpi_bfm_fc1_avmm_0_rw_inst USE_ARBITERLOCK 0
set_instance_parameter_value mm_agent_dpi_bfm_fc1_avmm_0_rw_inst USE_BEGIN_BURST_TRANSFER 0
set_instance_parameter_value mm_agent_dpi_bfm_fc1_avmm_0_rw_inst USE_BEGIN_TRANSFER 0
set_instance_parameter_value mm_agent_dpi_bfm_fc1_avmm_0_rw_inst USE_BURSTCOUNT 0
set_instance_parameter_value mm_agent_dpi_bfm_fc1_avmm_0_rw_inst USE_BYTE_ENABLE 1
set_instance_parameter_value mm_agent_dpi_bfm_fc1_avmm_0_rw_inst USE_CLKEN 0
set_instance_parameter_value mm_agent_dpi_bfm_fc1_avmm_0_rw_inst USE_DEBUGACCESS 0
set_instance_parameter_value mm_agent_dpi_bfm_fc1_avmm_0_rw_inst USE_LOCK 0
set_instance_parameter_value mm_agent_dpi_bfm_fc1_avmm_0_rw_inst USE_READ 1
set_instance_parameter_value mm_agent_dpi_bfm_fc1_avmm_0_rw_inst USE_READ_DATA 1
set_instance_parameter_value mm_agent_dpi_bfm_fc1_avmm_0_rw_inst USE_READ_DATA_VALID 0
set_instance_parameter_value mm_agent_dpi_bfm_fc1_avmm_0_rw_inst USE_WAIT_REQUEST 0
set_instance_parameter_value mm_agent_dpi_bfm_fc1_avmm_0_rw_inst USE_WRITE 1
set_instance_parameter_value mm_agent_dpi_bfm_fc1_avmm_0_rw_inst USE_WRITE_DATA 1

add_instance stream_source_dpi_bfm_fc1_bias_inst hls_sim_stream_source_dpi_bfm 1.0
set_instance_parameter_value stream_source_dpi_bfm_fc1_bias_inst COMPONENT_NAME fc1
set_instance_parameter_value stream_source_dpi_bfm_fc1_bias_inst EMPTY_WIDTH 0
set_instance_parameter_value stream_source_dpi_bfm_fc1_bias_inst FIRST_SYMBOL_IN_HIGH_ORDER_BITS 0
set_instance_parameter_value stream_source_dpi_bfm_fc1_bias_inst FORCE_STREAM_CONDUIT 1
set_instance_parameter_value stream_source_dpi_bfm_fc1_bias_inst INTERFACE_NAME bias
set_instance_parameter_value stream_source_dpi_bfm_fc1_bias_inst STREAM_BITSPERSYMBOL 1
set_instance_parameter_value stream_source_dpi_bfm_fc1_bias_inst STREAM_DATAWIDTH 64
set_instance_parameter_value stream_source_dpi_bfm_fc1_bias_inst USES_PACKETS 0

add_instance stream_source_dpi_bfm_fc1_in0_inst hls_sim_stream_source_dpi_bfm 1.0
set_instance_parameter_value stream_source_dpi_bfm_fc1_in0_inst COMPONENT_NAME fc1
set_instance_parameter_value stream_source_dpi_bfm_fc1_in0_inst EMPTY_WIDTH 0
set_instance_parameter_value stream_source_dpi_bfm_fc1_in0_inst FIRST_SYMBOL_IN_HIGH_ORDER_BITS 0
set_instance_parameter_value stream_source_dpi_bfm_fc1_in0_inst FORCE_STREAM_CONDUIT 1
set_instance_parameter_value stream_source_dpi_bfm_fc1_in0_inst INTERFACE_NAME in
set_instance_parameter_value stream_source_dpi_bfm_fc1_in0_inst STREAM_BITSPERSYMBOL 1
set_instance_parameter_value stream_source_dpi_bfm_fc1_in0_inst STREAM_DATAWIDTH 64
set_instance_parameter_value stream_source_dpi_bfm_fc1_in0_inst USES_PACKETS 0

add_instance stream_source_dpi_bfm_fc1_out0_inst hls_sim_stream_source_dpi_bfm 1.0
set_instance_parameter_value stream_source_dpi_bfm_fc1_out0_inst COMPONENT_NAME fc1
set_instance_parameter_value stream_source_dpi_bfm_fc1_out0_inst EMPTY_WIDTH 0
set_instance_parameter_value stream_source_dpi_bfm_fc1_out0_inst FIRST_SYMBOL_IN_HIGH_ORDER_BITS 0
set_instance_parameter_value stream_source_dpi_bfm_fc1_out0_inst FORCE_STREAM_CONDUIT 1
set_instance_parameter_value stream_source_dpi_bfm_fc1_out0_inst INTERFACE_NAME out
set_instance_parameter_value stream_source_dpi_bfm_fc1_out0_inst STREAM_BITSPERSYMBOL 1
set_instance_parameter_value stream_source_dpi_bfm_fc1_out0_inst STREAM_DATAWIDTH 64
set_instance_parameter_value stream_source_dpi_bfm_fc1_out0_inst USES_PACKETS 0

add_instance stream_source_dpi_bfm_fc1_weights_inst hls_sim_stream_source_dpi_bfm 1.0
set_instance_parameter_value stream_source_dpi_bfm_fc1_weights_inst COMPONENT_NAME fc1
set_instance_parameter_value stream_source_dpi_bfm_fc1_weights_inst EMPTY_WIDTH 0
set_instance_parameter_value stream_source_dpi_bfm_fc1_weights_inst FIRST_SYMBOL_IN_HIGH_ORDER_BITS 0
set_instance_parameter_value stream_source_dpi_bfm_fc1_weights_inst FORCE_STREAM_CONDUIT 1
set_instance_parameter_value stream_source_dpi_bfm_fc1_weights_inst INTERFACE_NAME weights
set_instance_parameter_value stream_source_dpi_bfm_fc1_weights_inst STREAM_BITSPERSYMBOL 1
set_instance_parameter_value stream_source_dpi_bfm_fc1_weights_inst STREAM_DATAWIDTH 64
set_instance_parameter_value stream_source_dpi_bfm_fc1_weights_inst USES_PACKETS 0

add_instance component_dpi_controller_fc1_inst hls_sim_component_dpi_controller 1.0
set_instance_parameter_value component_dpi_controller_fc1_inst COMPONENT_HAS_AGENT_RETURN 0
set_instance_parameter_value component_dpi_controller_fc1_inst COMPONENT_MANGLED_NAME "\\3ffc1@@YAXQEAMQEAY0BJA@M00@Z"
set_instance_parameter_value component_dpi_controller_fc1_inst COMPONENT_NAME fc1
set_instance_parameter_value component_dpi_controller_fc1_inst COMPONENT_NUM_AGENTS 0
set_instance_parameter_value component_dpi_controller_fc1_inst COMPONENT_NUM_OUTPUT_STREAMS 0
set_instance_parameter_value component_dpi_controller_fc1_inst RETURN_DATAWIDTH 64

add_instance fc1_component_dpi_controller_bind_conduit_fanout_inst avalon_conduit_fanout 1.0
set_instance_parameter_value fc1_component_dpi_controller_bind_conduit_fanout_inst numFanOut 5

add_instance fc1_component_dpi_controller_enable_conduit_fanout_inst avalon_conduit_fanout 1.0
set_instance_parameter_value fc1_component_dpi_controller_enable_conduit_fanout_inst numFanOut 5

add_instance fc1_component_dpi_controller_implicit_ready_conduit_fanout_inst avalon_conduit_fanout 1.0
set_instance_parameter_value fc1_component_dpi_controller_implicit_ready_conduit_fanout_inst numFanOut 4

add_instance mm_agent_dpi_bfm_fc3_avmm_0_rw_inst hls_sim_mm_agent_dpi_bfm 1.0
set_instance_parameter_value mm_agent_dpi_bfm_fc3_avmm_0_rw_inst ADDRESS_UNITS SYMBOLS
set_instance_parameter_value mm_agent_dpi_bfm_fc3_avmm_0_rw_inst ASSERT_HIGH_ARBITERLOCK 1
set_instance_parameter_value mm_agent_dpi_bfm_fc3_avmm_0_rw_inst ASSERT_HIGH_BYTEENABLE 1
set_instance_parameter_value mm_agent_dpi_bfm_fc3_avmm_0_rw_inst ASSERT_HIGH_LOCK 1
set_instance_parameter_value mm_agent_dpi_bfm_fc3_avmm_0_rw_inst ASSERT_HIGH_READ 1
set_instance_parameter_value mm_agent_dpi_bfm_fc3_avmm_0_rw_inst ASSERT_HIGH_READDATAVALID 1
set_instance_parameter_value mm_agent_dpi_bfm_fc3_avmm_0_rw_inst ASSERT_HIGH_WAITREQUEST 1
set_instance_parameter_value mm_agent_dpi_bfm_fc3_avmm_0_rw_inst ASSERT_HIGH_WRITE 1
set_instance_parameter_value mm_agent_dpi_bfm_fc3_avmm_0_rw_inst AV_ADDRESS_W 64
set_instance_parameter_value mm_agent_dpi_bfm_fc3_avmm_0_rw_inst AV_BURSTCOUNT_W 3
set_instance_parameter_value mm_agent_dpi_bfm_fc3_avmm_0_rw_inst AV_BURST_BNDR_ONLY 1
set_instance_parameter_value mm_agent_dpi_bfm_fc3_avmm_0_rw_inst AV_BURST_LINEWRAP 1
set_instance_parameter_value mm_agent_dpi_bfm_fc3_avmm_0_rw_inst AV_FIX_READ_LATENCY 1
set_instance_parameter_value mm_agent_dpi_bfm_fc3_avmm_0_rw_inst AV_MAX_PENDING_READS 0
set_instance_parameter_value mm_agent_dpi_bfm_fc3_avmm_0_rw_inst AV_MAX_PENDING_WRITES 0
set_instance_parameter_value mm_agent_dpi_bfm_fc3_avmm_0_rw_inst AV_NUMSYMBOLS 8
set_instance_parameter_value mm_agent_dpi_bfm_fc3_avmm_0_rw_inst AV_READRESPONSE_W 8
set_instance_parameter_value mm_agent_dpi_bfm_fc3_avmm_0_rw_inst AV_READ_WAIT_TIME 0
set_instance_parameter_value mm_agent_dpi_bfm_fc3_avmm_0_rw_inst AV_REGISTERINCOMINGSIGNALS 0
set_instance_parameter_value mm_agent_dpi_bfm_fc3_avmm_0_rw_inst AV_SYMBOL_W 8
set_instance_parameter_value mm_agent_dpi_bfm_fc3_avmm_0_rw_inst AV_WRITERESPONSE_W 8
set_instance_parameter_value mm_agent_dpi_bfm_fc3_avmm_0_rw_inst AV_WRITE_WAIT_TIME 0
set_instance_parameter_value mm_agent_dpi_bfm_fc3_avmm_0_rw_inst COMPONENT_NAME fc3
set_instance_parameter_value mm_agent_dpi_bfm_fc3_avmm_0_rw_inst INTERFACE_ID 0
set_instance_parameter_value mm_agent_dpi_bfm_fc3_avmm_0_rw_inst REGISTER_WAITREQUEST 0
set_instance_parameter_value mm_agent_dpi_bfm_fc3_avmm_0_rw_inst USE_ADDRESS 1
set_instance_parameter_value mm_agent_dpi_bfm_fc3_avmm_0_rw_inst USE_ARBITERLOCK 0
set_instance_parameter_value mm_agent_dpi_bfm_fc3_avmm_0_rw_inst USE_BEGIN_BURST_TRANSFER 0
set_instance_parameter_value mm_agent_dpi_bfm_fc3_avmm_0_rw_inst USE_BEGIN_TRANSFER 0
set_instance_parameter_value mm_agent_dpi_bfm_fc3_avmm_0_rw_inst USE_BURSTCOUNT 0
set_instance_parameter_value mm_agent_dpi_bfm_fc3_avmm_0_rw_inst USE_BYTE_ENABLE 1
set_instance_parameter_value mm_agent_dpi_bfm_fc3_avmm_0_rw_inst USE_CLKEN 0
set_instance_parameter_value mm_agent_dpi_bfm_fc3_avmm_0_rw_inst USE_DEBUGACCESS 0
set_instance_parameter_value mm_agent_dpi_bfm_fc3_avmm_0_rw_inst USE_LOCK 0
set_instance_parameter_value mm_agent_dpi_bfm_fc3_avmm_0_rw_inst USE_READ 1
set_instance_parameter_value mm_agent_dpi_bfm_fc3_avmm_0_rw_inst USE_READ_DATA 1
set_instance_parameter_value mm_agent_dpi_bfm_fc3_avmm_0_rw_inst USE_READ_DATA_VALID 0
set_instance_parameter_value mm_agent_dpi_bfm_fc3_avmm_0_rw_inst USE_WAIT_REQUEST 0
set_instance_parameter_value mm_agent_dpi_bfm_fc3_avmm_0_rw_inst USE_WRITE 1
set_instance_parameter_value mm_agent_dpi_bfm_fc3_avmm_0_rw_inst USE_WRITE_DATA 1

add_instance stream_source_dpi_bfm_fc3_bias_inst hls_sim_stream_source_dpi_bfm 1.0
set_instance_parameter_value stream_source_dpi_bfm_fc3_bias_inst COMPONENT_NAME fc3
set_instance_parameter_value stream_source_dpi_bfm_fc3_bias_inst EMPTY_WIDTH 0
set_instance_parameter_value stream_source_dpi_bfm_fc3_bias_inst FIRST_SYMBOL_IN_HIGH_ORDER_BITS 0
set_instance_parameter_value stream_source_dpi_bfm_fc3_bias_inst FORCE_STREAM_CONDUIT 1
set_instance_parameter_value stream_source_dpi_bfm_fc3_bias_inst INTERFACE_NAME bias
set_instance_parameter_value stream_source_dpi_bfm_fc3_bias_inst STREAM_BITSPERSYMBOL 1
set_instance_parameter_value stream_source_dpi_bfm_fc3_bias_inst STREAM_DATAWIDTH 64
set_instance_parameter_value stream_source_dpi_bfm_fc3_bias_inst USES_PACKETS 0
